# EAGLE design ProTrinket HPdisplay (EAGLE 6.5.0)
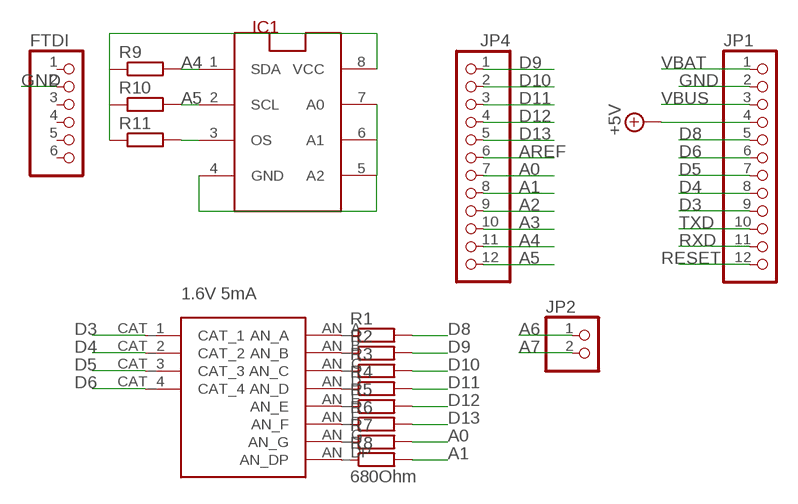
[diagram p0: schematic, sheet 1]

## Parts
FTDI  PINHD-1X6CB  [1X06-CLEANBIG]
IC1  LM75_ICN  [SO8_LM75]
JP1  PINHD-1X12-CB  [1X12-CB]
JP2  HEADER-1X2ROUND  [1X02_ROUND]
JP4  PINHD-1X12-CB  [1X12-CB]
R1  R-EU_R1206  [R1206]
R2  R-EU_R1206  [R1206]
R3  R-EU_R1206  [R1206]
R4  R-EU_R1206  [R1206]
R5  R-EU_R1206  [R1206]
R6  R-EU_R1206  [R1206]
R7  R-EU_R1206  [R1206]
R8  680Ohm  R-EU_R1206  [R1206]
R9  R-EU_R0603  [R0603]
R10  R-EU_R0603  [R0603]
R11  R-EU_R0603  [R0603]
U$1  QDSP-6064  [QDSP-6064]

## Nets
+5V: IC1.8(VCC) JP1.4 R9.1 R10.1 R11.1
A0: JP4.7 R7.2
A1: JP4.8 R8.2
A2: JP4.9
A3: JP4.10
A4: IC1.1(SDA) JP4.11 R9.2
A5: IC1.2(SCL) JP4.12 R10.2
A6: JP2.1
A7: JP2.2
AREF: JP4.6
D3: JP1.9 U$1.CAT_1
D4: JP1.8 U$1.CAT_2
D5: JP1.7 U$1.CAT_3
D6: JP1.6 U$1.CAT_4
D8: JP1.5 R1.2
D9: JP4.1 R2.2
D10: JP4.2 R3.2
D11: JP4.3 R4.2
D12: JP4.4 R5.2
D13: JP4.5 R6.2
GND [power]: FTDI.2 IC1.4(GND) IC1.5(A2) IC1.6(A1) IC1.7(A0) JP1.2
N$1: R1.1 U$1.AN_A
N$2: R2.1 U$1.AN_B
N$3: R3.1 U$1.AN_C
N$4: R4.1 U$1.AN_D
N$5: R5.1 U$1.AN_E
N$6: R6.1 U$1.AN_F
N$7: R7.1 U$1.AN_G
N$8: R8.1 U$1.AN_DP
N$11: IC1.3(OS) R11.2
RESET: JP1.12
RXD: JP1.11
TXD: JP1.10
VBAT [power]: JP1.1
VBUS [power]: JP1.3
Unconnected: FTDI.1 FTDI.3 FTDI.4 FTDI.5 FTDI.6

## Notes on the sheet
- 1.6V 5mA

## Library data of the parts
FTDI = adafruit:PINHD-1X6: PIN HEADER
IC1 = lm75:LM75_IC: Temperatursensor
JP1 JP4 = adafruit:PINHD-1X12: PIN HEADER
JP2 = microbuilder:HEADER-1X2: PIN HEADER
R1-R8 = rcl:R-EU_: RESISTOR, European symbol
R9-R11 = resistor:R-EU_: RESISTOR, European symbol
U$1 = QDSP-6064:QDSP-6064

## Net classes
1 power: width 0.305 mm

## Board
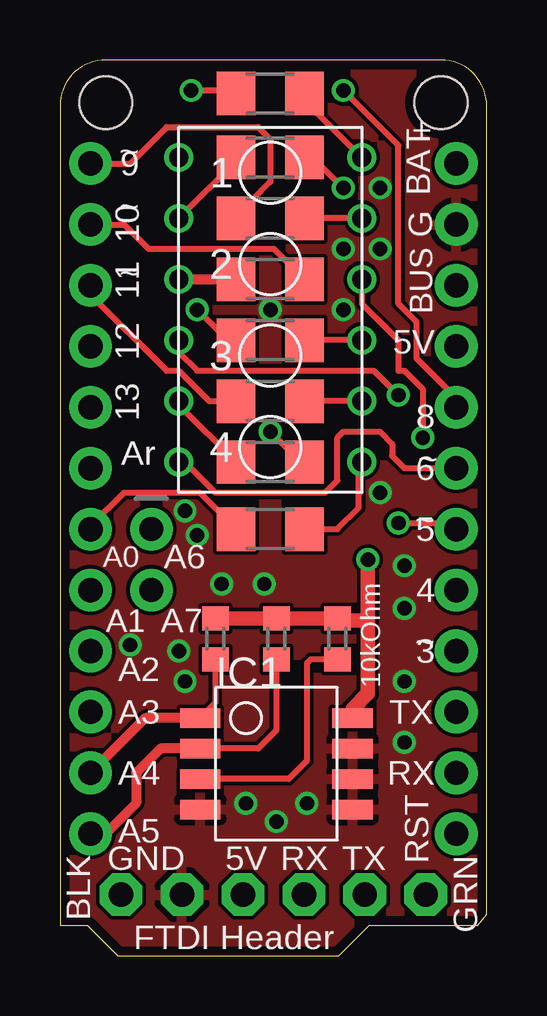
[diagram p1: board, top side]
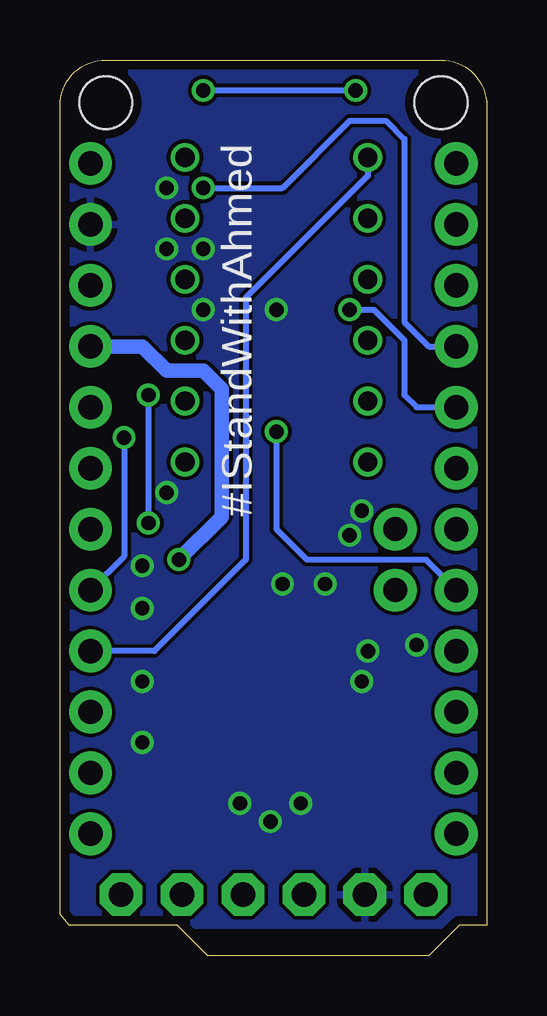
[diagram p2: board, bottom side, seen from below]

Size 17.78 x 37.34 mm. Coordinates in mm from the lower left corner, seen from the top.
Outline: 17.78,1.71 17.78,35.43 arc90 15.87,37.34 1.9,37.34 arc90 0,35.43 0,1.27 1.14,1.27 2.41,0 11.62,0 12.89,1.27 17.4,1.27 17.78,1.71
Copper layers (1*16): Top 0.0356mm / dielectric 1.5011mm / Bottom 0.0356mm
Design rules "LaenPCBOrder *": minimum track width 6mil, minimum drill 13mil, track to track 6mil, track to pad 6mil, pad to pad 6mil, via to via 6mil, smd to smd 6mil, copper to edge 15mil, drill to drill 6mil, minimum pad ring 7mil, minimum via ring 7mil, stop-mask expansion 3mil, vias tented up to drill 2000mil, thermal gap 10mil
Holes 2.2 mm at 1.9,35.56 15.87,35.56

### Footprints (pad centres in the part's own frame; a part is rotated, then mirrored left to right if it is on the bottom)
1X06-CLEANBIG = drill 1.016 pad 1.778 octagon: 1 -6.35,0; 2 -3.81,0; 3 -1.27,0; 4 1.27,0; 5 3.81,0; 6 6.35,0
SO8_LM75 = smd 0.813 x 1.676: 1 -1.27,-3.175; 2 0,-3.175; 3 1.27,-3.175; 4 2.54,-3.175; 5 2.54,3.175; 6 1.27,3.175; 7 0,3.175; 8 -1.27,3.175
1X12-CB = drill 1.016 pad 1.778: 1 -13.97,0; 2 -11.43,0; 3 -8.89,0; 4 -6.35,0; 5 -3.81,0; 6 -1.27,0; 7 1.27,0; 8 3.81,0; 9 6.35,0; 10 8.89,0; 11 11.43,0; 12 13.97,0
1X02_ROUND = drill 1 pad 1.778: 1 -1.27,0; 2 1.27,0
R1206 = smd 1.6 x 1.803: 1 -1.422,0; 2 1.422,0
R0603 = smd 1 x 1.1: 1 -0.85,0; 2 0.85,0
QDSP-6064 = drill 0.8: AN_A 3.81,6.35; AN_B 3.81,3.81; AN_C -3.81,1.27; AN_D 3.81,-3.81; AN_DP -3.81,-3.81; AN_E -3.81,3.81; AN_F 3.81,-1.27; AN_G 3.81,-6.35; CAT_1 -3.81,6.35; CAT_2 3.81,1.27; CAT_3 -3.81,-1.27; CAT_4 -3.81,-6.35

### Placement (x,y rotation side)
FTDI  8.89,2.54 0 top
IC1  9.02,8.64 270 top
JP1  16.51,19.05 270 top
JP2  3.81,16.51 270 top
JP4  1.27,19.05 270 top
R1  8.76,35.94 180 top
R2  8.76,30.73 180 top
R3  8.76,28.19 0 top
R4  8.76,23.11 180 top
R5  8.76,33.27 0 top
R6  8.76,25.65 180 top
R7  8.76,17.78 180 top
R8  8.76,20.57 0 top
R9  6.48,13.21 270 top
R10  9.02,13.21 270 top
R11  11.56,13.21 270 top
U$1  8.76,26.92 0 top

### Tracks (layer width: path | path; a pad name or v marks a point on that pad's centre or on a via)
+5V  (via drill 0.6)
  Top 0.254: 12.83,16.76 v12.83,16.51 | 11.64,13.97 R11.1
  Top 0.61: R11.1 R10.1 R9.1 | IC1.8 12.19,10.29 12.83,10.92 12.83,13.97 | v12.83,16.51 12.83,13.97 | 12.83,13.97 11.64,13.97
  Bottom 0.61: JP1.4 14.35,25.4 13.33,24.38 11.81,24.38 11.05,23.62 11.05,18.29 v12.83,16.51
A0
  Top 0.254: JP4.7 1.27,17.91 2.67,19.3 5.82,19.3 R7.2
A1  (via drill 0.6)
  Top 0.254: R8.2 10.03,20.57 v8.76,21.84
  Bottom 0.254: v8.76,21.84 8.76,17.78 7.49,16.51 2.54,16.51 JP4.8
A4
  Top 0.254: R9.2 6.48,10.54 IC1.1
  Top 0.406: IC1.1 3.56,9.91 JP4.11
A5
  Top 0.254: R10.2 9.02,9.4 8.26,8.64 IC1.2
  Top 0.406: IC1.2 4.19,8.64 3.17,7.62 3.17,6.35 1.9,5.08 JP4.12
D3
  Bottom 0.254: U$1.CAT_1 4.95,32.51 10.03,27.43 10.03,16.51 13.84,12.7 JP1.9
D4  (via drill 0.6)
  Top 0.254: U$1.CAT_2 12.57,27.18 14.1,25.65 14.1,24.38 14.35,24.38 15.11,23.62 v15.11,21.59
  Bottom 0.254: v15.11,21.59 15.11,16.64 JP1.8
D5  (via drill 0.6)
  Top 0.254: U$1.CAT_3 4.95,25.15 5.71,24.38 13.08,24.38 v14.1,23.37 | v14.1,18.03 16.26,18.03 JP1.7
  Bottom 0.254: v14.1,23.37 v14.1,18.03
D6
  Top 0.254: U$1.CAT_4 5.21,20.57 6.48,19.3 11.05,19.3 11.56,19.81 11.56,21.59 11.81,21.84 13.33,21.84 13.84,21.34 13.84,20.83 14.35,20.32 JP1.6
D8  (via drill 0.6)
  Top 0.254: JP1.5 16.51,23.24 14.86,24.89 14.86,26.42 14.1,27.18 14.1,33.78 v11.81,36.07 | v5.46,36.07 7.21,36.07 R1.2
  Bottom 0.254: v11.81,36.07 v5.46,36.07
D9
  Top 0.254: JP4.1 2.92,33.02 4.44,34.54 8.26,34.54 8.76,34.04 8.76,32.26 8,31.5 R2.2
D10
  Top 0.254: JP4.2 2.67,30.48 3.68,29.46 8.91,29.46 R3.2
D11
  Top 0.254: JP4.3 1.27,27.56 4.44,24.38 4.95,24.38 6.22,23.11 R4.2
D12  (via drill 0.6)
  Top 0.254: R5.2 10.54,33.27 v11.81,32
  Bottom 0.254: v11.81,32 8.51,32 5.71,34.8 4.19,34.8 3.43,34.04 3.43,26.42 2.41,25.4 JP4.4
D13  (via drill 0.6)
  Top 0.254: R6.2 6.98,25.65 v5.71,26.92
  Bottom 0.254: v5.71,26.92 4.7,26.92 3.43,25.65 3.43,23.37 2.92,22.86 JP4.5
GND  (via drill 0.6)
  other vias: 10.29,6.35 2.92,12.95 7.75,6.35 14.35,14.48 4.95,12.7 5.21,11.43 14.35,11.43 14.35,16.26 11.81,29.46 11.81,26.92 8.76,26.92 14.35,8.89 9.02,5.59 13.33,32 13.33,29.46 13.33,19.3 5.21,18.54 6.73,15.49 8.51,15.49 5.71,17.53
  pour Bottom: 0,38.1 0,1.27 17.78,1.27 17.78,38.1
  pour Top: -1.65,40.64 18.67,40.64 18.67,-2.54 -1.65,-2.54
N$1
  Top 0.254: 10.41,35.43 U$1.AN_A
  Top 0.406: R1.1 10.41,35.43
N$2
  Top 0.254: U$1.AN_B R2.1
N$3
  Top 0.406: U$1.AN_C R3.1
N$4
  Top 0.254: U$1.AN_D R4.1
N$5
  Top 0.254: 7.34,33.12 U$1.AN_E
  Top 0.406: R5.1 7.34,33.12
N$6
  Top 0.254: U$1.AN_F R6.1
N$7
  Top 0.254: R7.1 11.56,17.78 12.45,18.67 12.45,20.45 U$1.AN_G
N$8
  Top 0.254: 4.95,22.96 R8.1
  Top 0.406: U$1.AN_DP 4.95,22.96
N$11
  Top 0.254: R11.2 10.45,12.36 10.29,12.19 10.29,8.13 9.53,7.37 IC1.3

### Text on the board
tPlace: + | 9 | ~ | ~ | BAT | G | 10 | 11 | BUS | ~ | 12 | 5V | 13 | 8 | Ar | 6 | ~ | ~ | 5 | A0 | A6 | 4 | A1 | A7 | ~ | 3 | A2 | 10kOhm | A3 | TX | A4 | RX | RST | A5 | BLK | GND | 5V | RX | TX | GRN | FTDI Header
bNames: #IStandWithAhmed